# Altium schematic sheet Блок1.1.SchDoc
size A4; DocumentNumber: 3; SheetNumber: 3; SheetTotal: 12
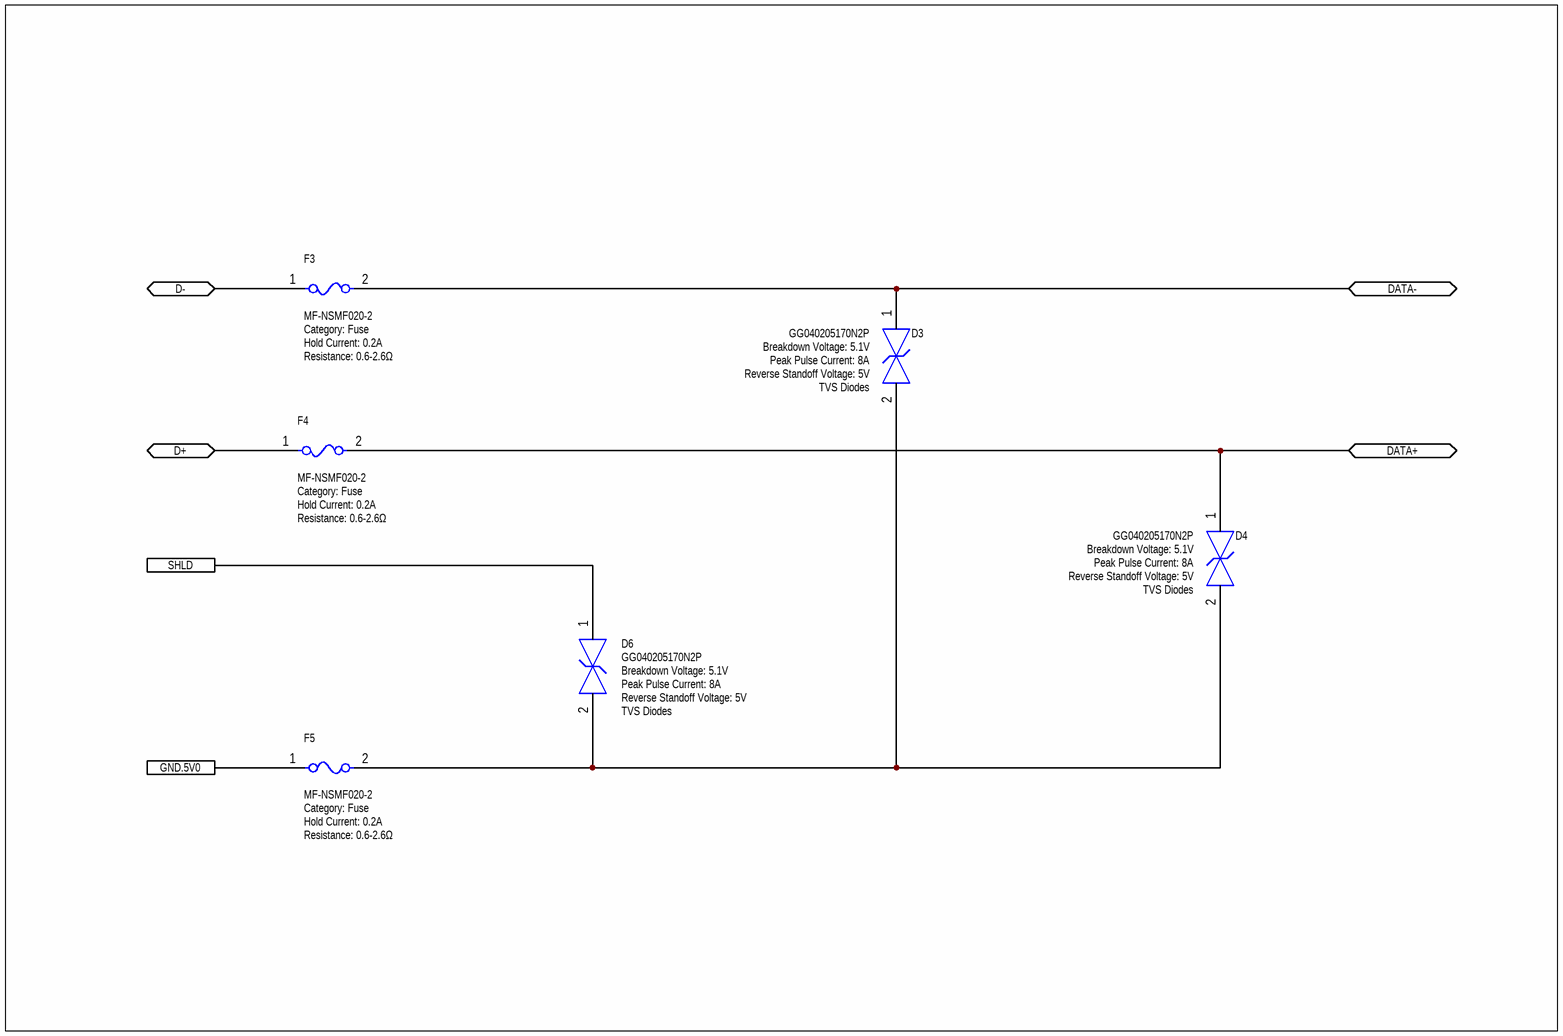
[diagram p0: Блок1.1.SchDoc]

## Parts
D3  GG040205170N2P  Breakdown Voltage: 5.1V  Peak Pulse Current: 8A  Reverse Standoff Voltage: 5V  Device Class L2: TVS Diodes  [FP-GG0402-IPC_A]
D4  GG040205170N2P  Breakdown Voltage: 5.1V  Peak Pulse Current: 8A  Reverse Standoff Voltage: 5V  Device Class L2: TVS Diodes  [FP-GG0402-IPC_A]
D6  GG040205170N2P  Breakdown Voltage: 5.1V  Peak Pulse Current: 8A  Reverse Standoff Voltage: 5V  Device Class L2: TVS Diodes  [FP-GG0402-IPC_A]
F3  MF-NSMF020-2  Category: Fuse  Hold Current: 0.2A  Resistance: 0.6-2.6Ω  [FP-MF-NSMF020-2-MFG]
F4  MF-NSMF020-2  Category: Fuse  Hold Current: 0.2A  Resistance: 0.6-2.6Ω  [FP-MF-NSMF020-2-MFG]
F5  MF-NSMF020-2  Category: Fuse  Hold Current: 0.2A  Resistance: 0.6-2.6Ω  [FP-MF-NSMF020-2-MFG]

## Ports
D+ (bidir), D- (bidir), DATA+ (bidir), DATA- (bidir), GND.5V0, SHLD

## Nets
D+: F4.1 ; port D+
D-: F3.1 ; port D-
DATA+: D4.1 F4.2 ; port DATA+
DATA-: D3.1 F3.2 ; port DATA-
GND.5V0: F5.1 ; port GND.5V0
SHLD: D6.1 ; port SHLD
NetD3_2: D3.2 D4.2 D6.2 F5.2

## Library data of the parts
D3 D4 D6 = CMP-04587-000002-1: TVS DIODE 5V 10V 0402; Manufacturer: AVX; Capacitance: 17pF; Peak Pulse Power: 80W; Value: 17pF; Number Of Channels: 1; Direction: Bidirectional; Manufacturer Part Number: GG040205170N2P; Temperature: -55°C to +125°C; Octopart: https://octopart.com/gg040205170n2p-avx-81066082; RoHS: TRUE; Clamping Voltage: 10V; Device Class L1: Circuit Protection; ComponentLink2Description: Datasheet; Category: Diode; Package: GG0402; Temperature Range High: +125°C; Digikey Description: TVS DIODE 5V 10V 0402; Ipc Land Pattern Name: DIOC10060X50; Device Class L3: unset; Automotive: No; Mouser Description: ESD Suppressor TVS Bi-Dir 5V 2-Pin Case 0402(1006Metric) T/R; ComponentLink2URL: http://datasheets.avx.com/AVX-GiGuard.pdf; Height: 0.55mm; Lead Free: Yes; Temperature Range Low: -55°C
F3-F5 = CMP-07400-000029-1: PTC RESET FUSE 24V 200MA 1206; Manufacturer: Bourns; Trip Current: 0.46A; Trip Time: 0.6s; Current Rating: 10A; Automotive Grade: Grade 3; Value: 0.6-2.6Ω; Voltage Rating: 24V; Ambient Temperature Range Low: -40°C; Device Class L1: Circuit Protection; Temperature Range Low: -40°C; Temperature: -40°C to +85°C; Temperature Range High: +85°C; Mouser Description: Resettable Fuses - PPTC 0.20A 24V 0.60ohm MAX (R); Device Class L3: unset; RoHS: TRUE; Package: MF-NSMF020-2; Ambient Temperature Range High: +85°C; ComponentLink2Description: Datasheet; Digikey Description: PTC RESET FUSE 24V 200MA 1206; Device Class L2: PTC Resettable Fuses; Manufacturer Part Number: MF-NSMF020-2; Octopart: https://octopart.com/mf-nsmf020-2-bourns-94649; Automotive: Yes; Height: 0.85mm; Lead Free: Yes; ComponentLink2URL: https://www.bourns.com/docs/Product-Datasheets/mfnsmf.pdf